# Altium schematic sheet Page05 LPDDR4.SchDoc
size 513 x 386 mm
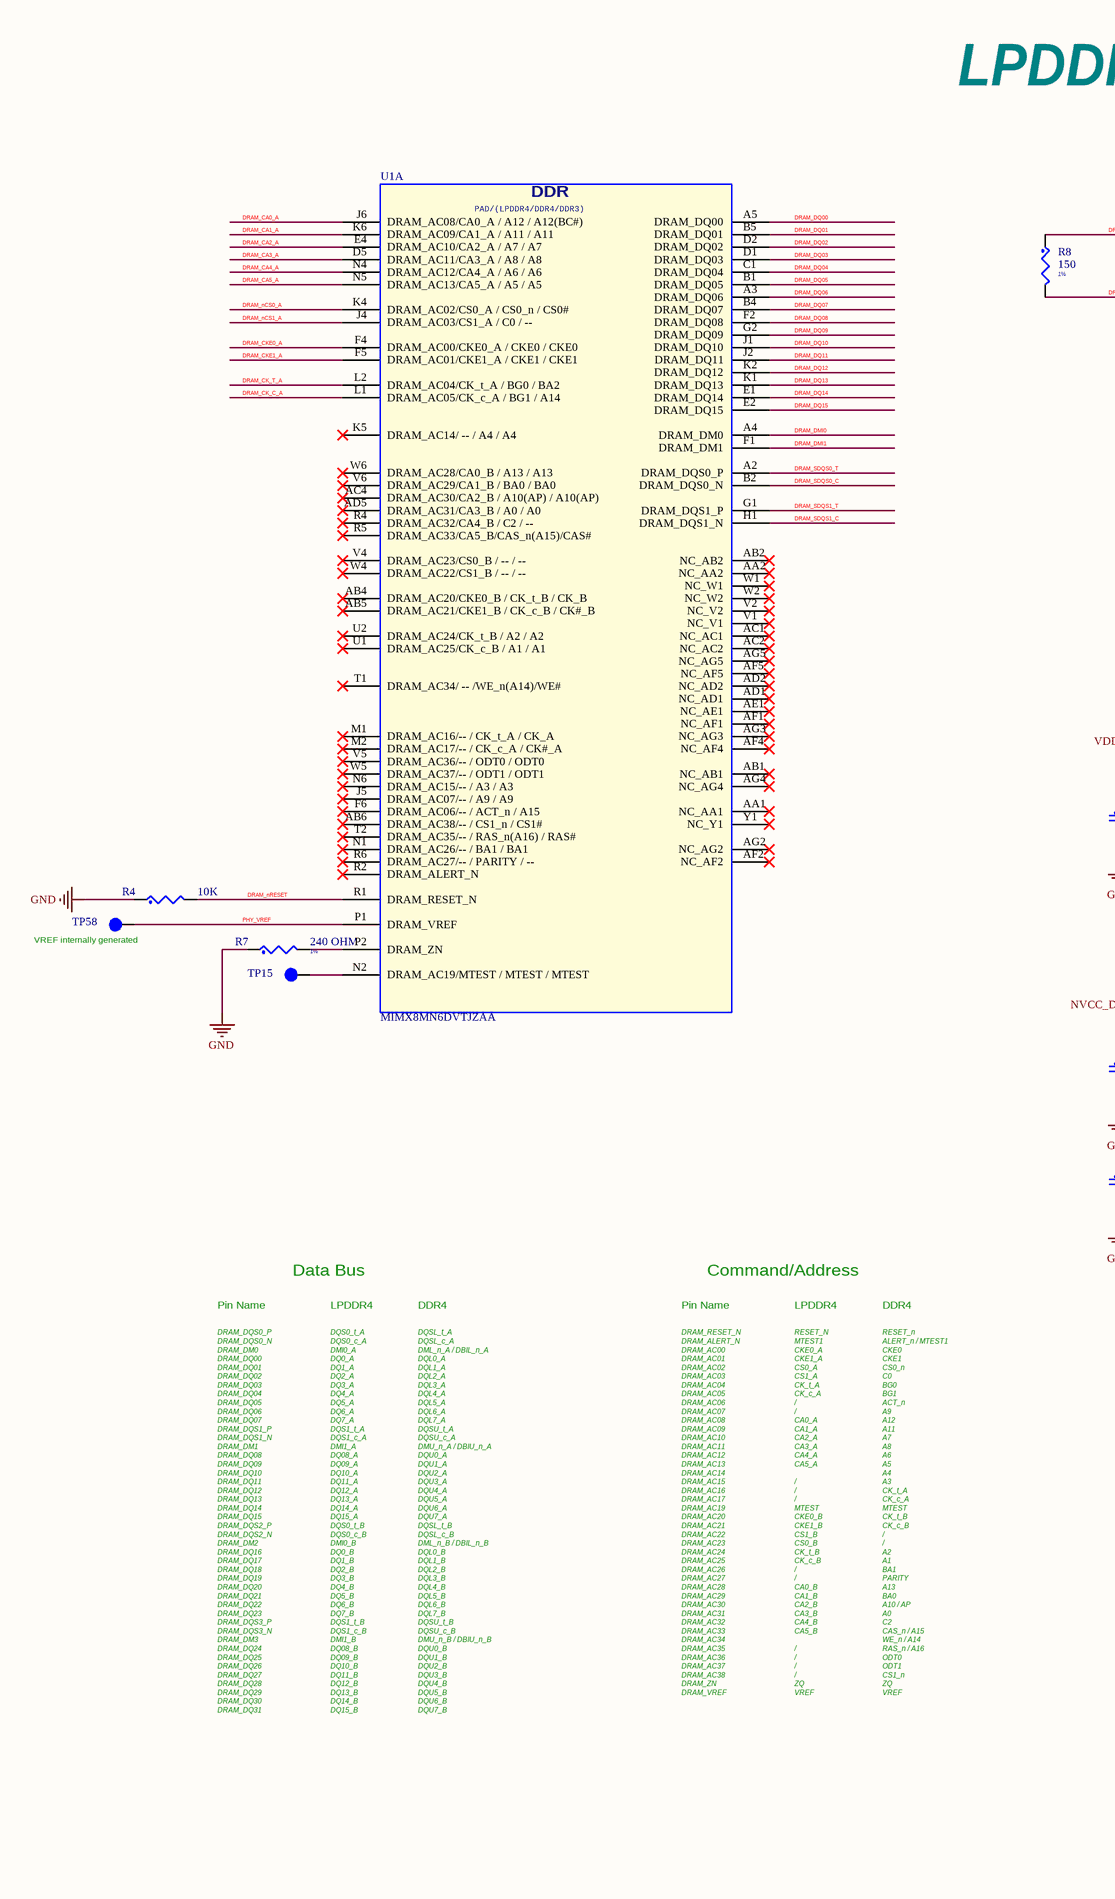
[diagram p0: Page05 LPDDR4.SchDoc, left]
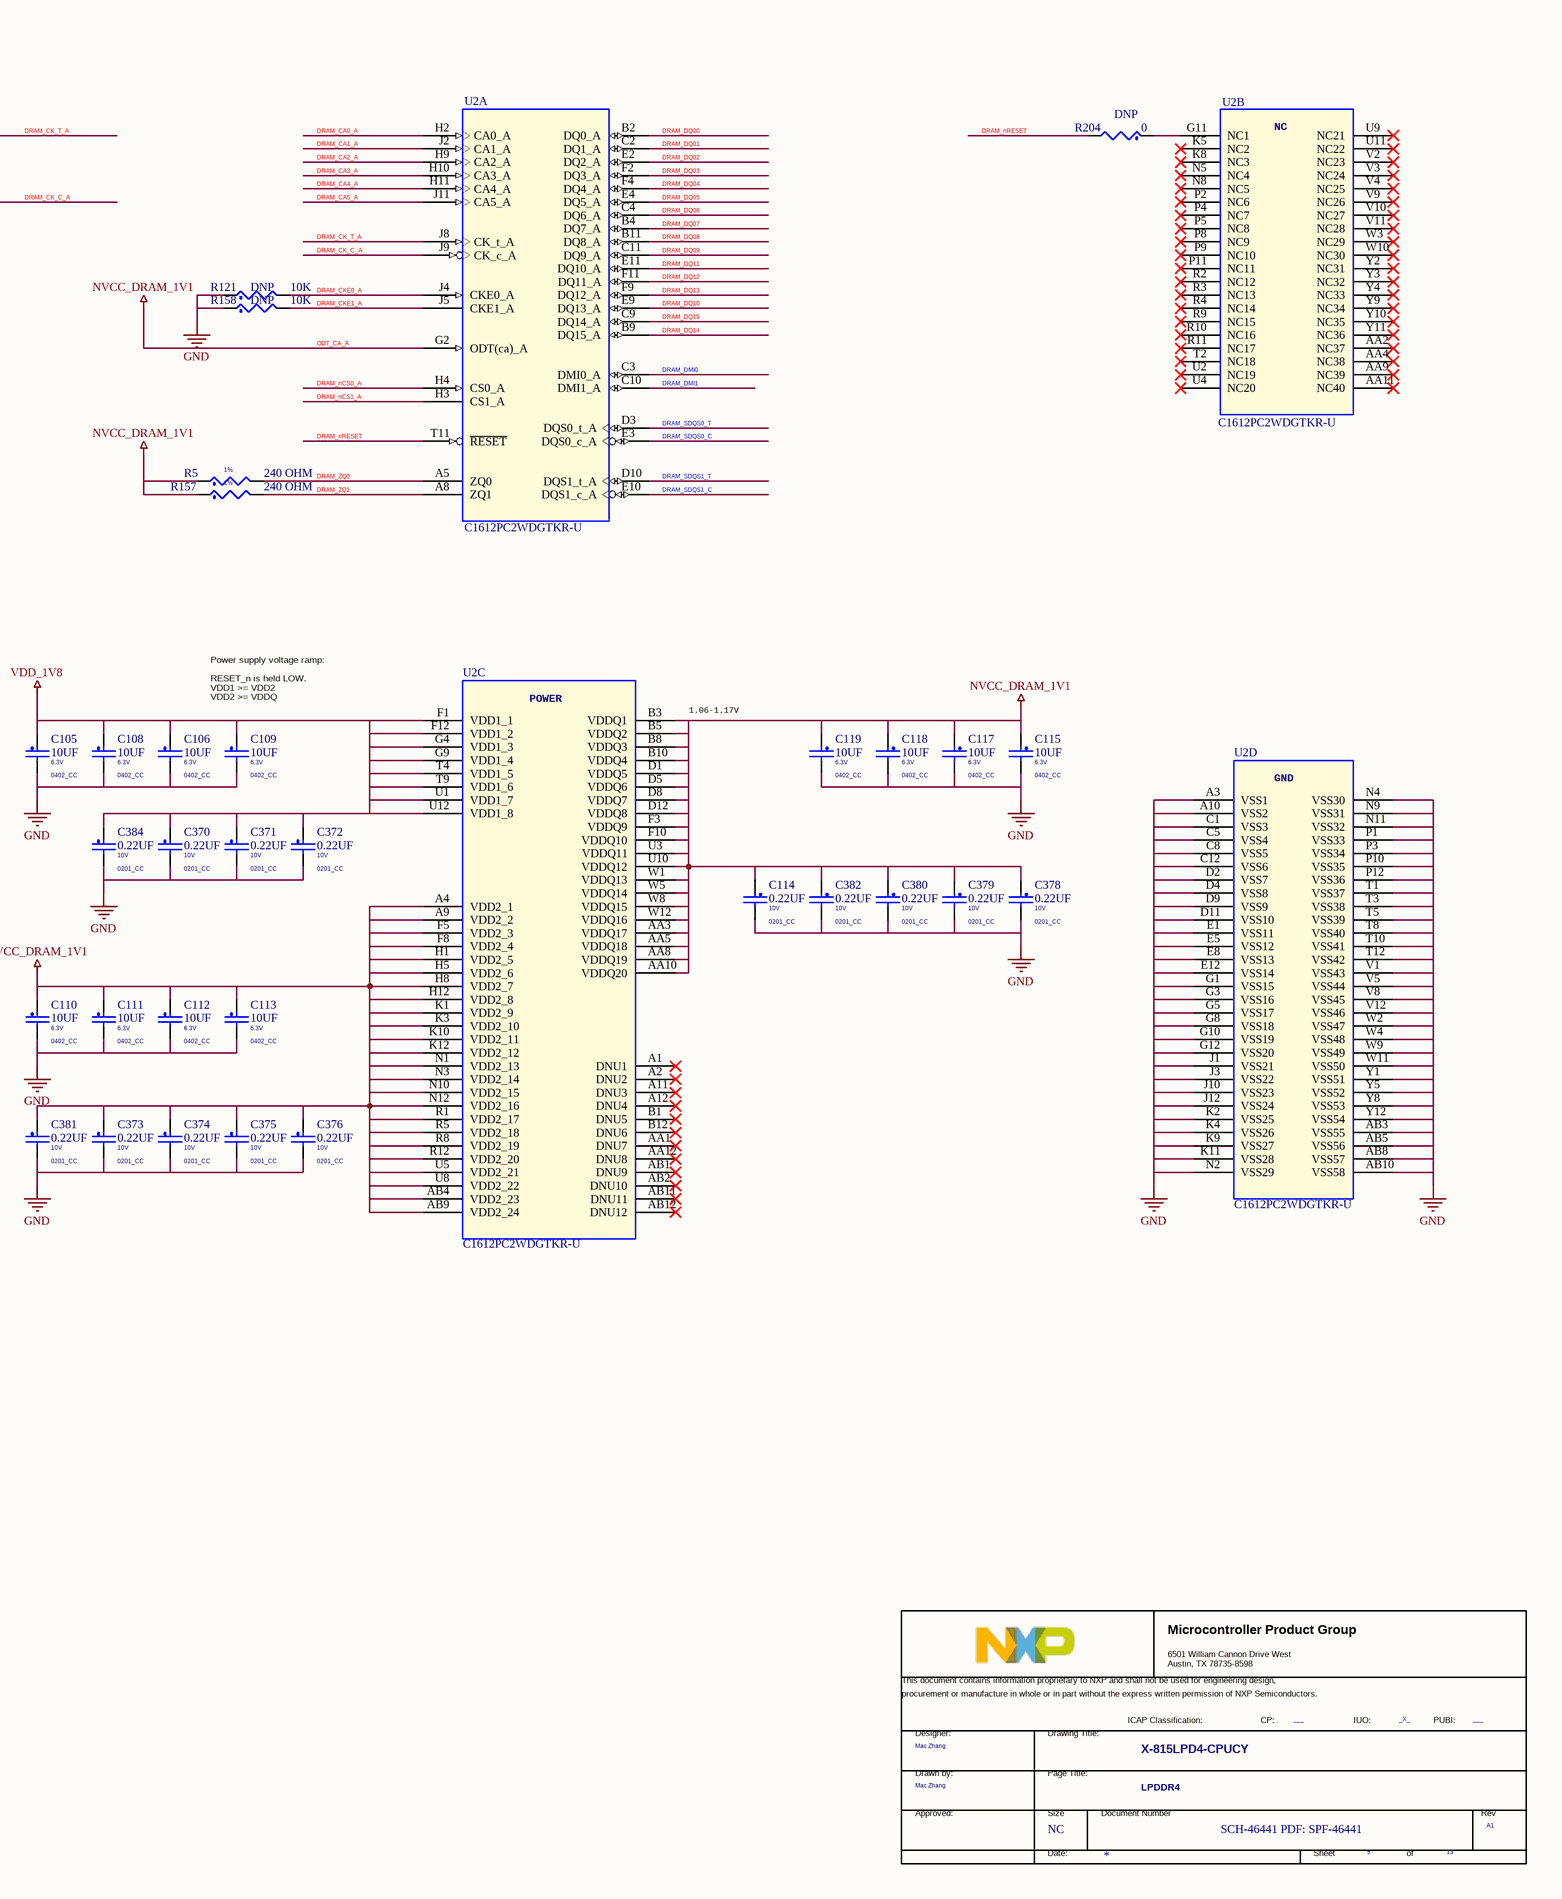
[diagram p1: Page05 LPDDR4.SchDoc, right]

## Parts
*  Doc: SCH-46441 PDF: SPF-46441  RevCode: A1  Title: X-815LPD4-CPUCY  Page Size: NC  Page Number: 5  Page Count: 13  PageTitle: LPDDR4  Designer: Mac Zhang  PUBI: ___  FIUO: _X_  (hidden comment: TitleBlock_MCPG)  (graphical)
C105  10UF  VOLTAGE: 6.3V  [0402_CC]
C106  10UF  VOLTAGE: 6.3V  [0402_CC]
C108  10UF  VOLTAGE: 6.3V  [0402_CC]
C109  10UF  VOLTAGE: 6.3V  [0402_CC]
C110  10UF  VOLTAGE: 6.3V  [0402_CC]
C111  10UF  VOLTAGE: 6.3V  [0402_CC]
C112  10UF  VOLTAGE: 6.3V  [0402_CC]
C113  10UF  VOLTAGE: 6.3V  [0402_CC]
C114  0.22UF  VOLTAGE: 10V  [0201_CC]
C115  10UF  VOLTAGE: 6.3V  [0402_CC]
C117  10UF  VOLTAGE: 6.3V  [0402_CC]
C118  10UF  VOLTAGE: 6.3V  [0402_CC]
C119  10UF  VOLTAGE: 6.3V  [0402_CC]
C370  0.22UF  VOLTAGE: 10V  [0201_CC]
C371  0.22UF  VOLTAGE: 10V  [0201_CC]
C372  0.22UF  VOLTAGE: 10V  [0201_CC]
C373  0.22UF  VOLTAGE: 10V  [0201_CC]
C374  0.22UF  VOLTAGE: 10V  [0201_CC]
C375  0.22UF  VOLTAGE: 10V  [0201_CC]
C376  0.22UF  VOLTAGE: 10V  [0201_CC]
C378  0.22UF  VOLTAGE: 10V  [0201_CC]
C379  0.22UF  VOLTAGE: 10V  [0201_CC]
C380  0.22UF  VOLTAGE: 10V  [0201_CC]
C381  0.22UF  VOLTAGE: 10V  [0201_CC]
C382  0.22UF  VOLTAGE: 10V  [0201_CC]
C384  0.22UF  VOLTAGE: 10V  [0201_CC]
R4  10K  [0201_CC]
R5  240 OHM  Tolerance: 1%  [0201_CC]
R7  240 OHM  Tolerance: 1%  [0201_CC]
R8  150  Tolerance: 1%  [0402_CC]
R121  10K  ASSY_OPT: DNP  [0201_CC]
R157  240 OHM  Tolerance: 1%  [0201_CC]
R158  10K  ASSY_OPT: DNP  [0201_CC]
R204  0  ASSY_OPT: DNP  [0402_CC]
TP15  tpad_020  [tpad_020]  (value not drawn)
TP58  tpad_020  [tpad_020]  (value not drawn)
U1  MIMX8MN6DVTJZAA  [bga486_0p5_14x14]  (part A of 14)
U2  C1612PC2WDGTKR-U  [bga200_0p65x0p8_10p1x14p6]  (parts A,B,C,D of 4)

## Nets
GND: C105.2 C106.2 C108.2 C109.2 C110.2 C111.2 C112.2 C113.2 C114.2 C115.2 C117.2 C118.2 C119.2 C370.2 C371.2 C372.2 C373.2 C374.2 C375.2 C376.2 C378.2 C379.2 C380.2 C381.2 C382.2 C384.2 R4.1 R7.1 R121.1 R158.1 U2.A3(VSS1) U2.A10(VSS2) U2.AB3(VSS55) U2.AB5(VSS56) U2.AB8(VSS57) U2.AB10(VSS58) U2.C1(VSS3) U2.C5(VSS4) U2.C8(VSS5) U2.C12(VSS6) U2.D2(VSS7) U2.D4(VSS8) U2.D9(VSS9) U2.D11(VSS10) U2.E1(VSS11) U2.E5(VSS12) U2.E8(VSS13) U2.E12(VSS14) U2.G1(VSS15) U2.G3(VSS16) U2.G5(VSS17) U2.G8(VSS18) U2.G10(VSS19) U2.G12(VSS20) U2.J1(VSS21) U2.J3(VSS22) U2.J10(VSS23) U2.J12(VSS24) U2.K2(VSS25) U2.K4(VSS26) U2.K9(VSS27) U2.K11(VSS28) U2.N2(VSS29) U2.N4(VSS30) U2.N9(VSS31) U2.N11(VSS32) U2.P1(VSS33) U2.P3(VSS34) U2.P10(VSS35) U2.P12(VSS36) U2.T1(VSS37) U2.T3(VSS38) U2.T5(VSS39) U2.T8(VSS40) U2.T10(VSS41) U2.T12(VSS42) U2.V1(VSS43) U2.V5(VSS44) U2.V8(VSS45) U2.V12(VSS46) U2.W2(VSS47) U2.W4(VSS48) U2.W9(VSS49) U2.W11(VSS50) U2.Y1(VSS51) U2.Y5(VSS52) U2.Y8(VSS53) U2.Y12(VSS54)
ODT_CA_A: C110.1 C111.1 C112.1 C113.1 C114.1 C115.1 C117.1 C118.1 C119.1 C373.1 C374.1 C375.1 C376.1 C378.1 C379.1 C380.1 C381.1 C382.1 R5.1 R157.1 U2.A4(VDD2_1) U2.A9(VDD2_2) U2.AA3(VDDQ17) U2.AA5(VDDQ18) U2.AA8(VDDQ19) U2.AA10(VDDQ20) U2.AB4(VDD2_23) U2.AB9(VDD2_24) U2.B3(VDDQ1) U2.B5(VDDQ2) U2.B8(VDDQ3) U2.B10(VDDQ4) U2.D1(VDDQ5) U2.D5(VDDQ6) U2.D8(VDDQ7) U2.D12(VDDQ8) U2.F3(VDDQ9) U2.F5(VDD2_3) U2.F8(VDD2_4) U2.F10(VDDQ10) U2.G2(ODT(ca)_A) U2.H1(VDD2_5) U2.H5(VDD2_6) U2.H8(VDD2_7) U2.H12(VDD2_8) U2.K1(VDD2_9) U2.K3(VDD2_10) U2.K10(VDD2_11) U2.K12(VDD2_12) U2.N1(VDD2_13) U2.N3(VDD2_14) U2.N10(VDD2_15) U2.N12(VDD2_16) U2.R1(VDD2_17) U2.R5(VDD2_18) U2.R8(VDD2_19) U2.R12(VDD2_20) U2.U3(VDDQ11) U2.U5(VDD2_21) U2.U8(VDD2_22) U2.U10(VDDQ12) U2.W1(VDDQ13) U2.W5(VDDQ14) U2.W8(VDDQ15) U2.W12(VDDQ16)  [also labelled NVCC_DRAM_1V1]
VDD_1V8: C105.1 C106.1 C108.1 C109.1 C370.1 C371.1 C372.1 C384.1 U2.F1(VDD1_1) U2.F12(VDD1_2) U2.G4(VDD1_3) U2.G9(VDD1_4) U2.T4(VDD1_5) U2.T9(VDD1_6) U2.U1(VDD1_7) U2.U12(VDD1_8)
DRAM_CA0_A: U1.J6(DRAM_AC08/CA0_A_/_A12_/_A12(BC#)) U2.H2(CA0_A)
DRAM_CA1_A: U1.K6(DRAM_AC09/CA1_A_/_A11_/_A11) U2.J2(CA1_A)
DRAM_CA2_A: U1.E4(DRAM_AC10/CA2_A_/_A7_/_A7) U2.H9(CA2_A)
DRAM_CA3_A: U1.D5(DRAM_AC11/CA3_A_/_A8_/_A8) U2.H10(CA3_A)
DRAM_CA4_A: U1.N4(DRAM_AC12/CA4_A_/_A6_/_A6) U2.H11(CA4_A)
DRAM_CA5_A: U1.N5(DRAM_AC13/CA5_A_/_A5_/_A5) U2.J11(CA5_A)
DRAM_CK_C_A: R8.2 U1.L1(DRAM_AC05/CK_c_A_/_BG1_/_A14) U2.J9(CK_c_A)
DRAM_CK_T_A: R8.1 U1.L2(DRAM_AC04/CK_t_A_/_BG0_/_BA2) U2.J8(CK_t_A)
DRAM_CKE0_A: R121.2 U1.F4(DRAM_AC00/CKE0_A_/_CKE0_/_CKE0) U2.J4(CKE0_A)
DRAM_CKE1_A: R158.2 U1.F5(DRAM_AC01/CKE1_A_/_CKE1_/_CKE1) U2.J5(CKE1_A)
DRAM_DMI0: U1.A4(DRAM_DM0) U2.C3(DMI0_A)
DRAM_DMI1: U1.F1(DRAM_DM1) U2.C10(DMI1_A)
DRAM_DQ00: U1.A5(DRAM_DQ00) U2.B2(DQ0_A)
DRAM_DQ01: U1.B5(DRAM_DQ01) U2.C2(DQ1_A)
DRAM_DQ02: U1.D2(DRAM_DQ02) U2.E2(DQ2_A)
DRAM_DQ03: U1.D1(DRAM_DQ03) U2.F2(DQ3_A)
DRAM_DQ04: U1.C1(DRAM_DQ04) U2.F4(DQ4_A)
DRAM_DQ05: U1.B1(DRAM_DQ05) U2.E4(DQ5_A)
DRAM_DQ06: U1.A3(DRAM_DQ06) U2.C4(DQ6_A)
DRAM_DQ07: U1.B4(DRAM_DQ07) U2.B4(DQ7_A)
DRAM_DQ08: U1.F2(DRAM_DQ08) U2.B11(DQ8_A)
DRAM_DQ09: U1.G2(DRAM_DQ09) U2.C11(DQ9_A)
DRAM_DQ10: U1.J1(DRAM_DQ10) U2.E9(DQ13_A)
DRAM_DQ11: U1.J2(DRAM_DQ11) U2.E11(DQ10_A)
DRAM_DQ12: U1.K2(DRAM_DQ12) U2.F11(DQ11_A)
DRAM_DQ13: U1.K1(DRAM_DQ13) U2.F9(DQ12_A)
DRAM_DQ14: U1.E1(DRAM_DQ14) U2.B9(DQ15_A)
DRAM_DQ15: U1.E2(DRAM_DQ15) U2.C9(DQ14_A)
DRAM_nCS0_A: U1.K4(DRAM_AC02/CS0_A_/_CS0_n_/_CS0#) U2.H4(CS0_A)
DRAM_nCS1_A: U1.J4(DRAM_AC03/CS1_A_/_C0_/_--) U2.H3(CS1_A)
DRAM_nRESET: R4.2 R204.2 U1.R1(DRAM_RESET_N) U2.T11(~{RESET})
DRAM_SDQS0_C: U1.B2(DRAM_DQS0_N) U2.E3(DQS0_c_A)
DRAM_SDQS0_T: U1.A2(DRAM_DQS0_P) U2.D3(DQS0_t_A)
DRAM_SDQS1_C: U1.H1(DRAM_DQS1_N) U2.E10(DQS1_c_A)
DRAM_SDQS1_T: U1.G1(DRAM_DQS1_P) U2.D10(DQS1_t_A)
DRAM_ZQ0: R5.2 U2.A5(ZQ0)
DRAM_ZQ1: R157.2 U2.A8(ZQ1)
PHY_VREF: TP58.1(Pin1) U1.P1(DRAM_VREF)
NetR7_2: R7.2 U1.P2(DRAM_ZN)
NetR204_1: R204.1 U2.G11(NC1)
NetTP15_1: TP15.1(Pin1) U1.N2(DRAM_AC19/MTEST_/_MTEST_/_MTEST)

Not connected (* = marked no-connect by the designer): U1 AA1(NC_AA1)* AA2(NC_AA2)* AB1(NC_AB1)* AB2(NC_AB2)* AB4(DRAM_AC20/CKE0_B_/_CK_t_B_/_CK_B)* AB5(DRAM_AC21/CKE1_B_/_CK_c_B_/_CK#_B)* AB6(DRAM_AC38/--_/_CS1_n_/_CS1#)* AC1(NC_AC1)* AC2(NC_AC2)* AC4(DRAM_AC30/CA2_B_/_A10(AP)_/_A10(AP))* AD1(NC_AD1)* AD2(NC_AD2)* AD5(DRAM_AC31/CA3_B_/_A0_/_A0)* AE1(NC_AE1)* AF1(NC_AF1)* AF2(NC_AF2)* AF4(NC_AF4)* AF5(NC_AF5)* AG2(NC_AG2)* AG3(NC_AG3)* AG4(NC_AG4)* AG5(NC_AG5)* F6(DRAM_AC06/--_/_ACT_n_/_A15)* J5(DRAM_AC07/--_/_A9_/_A9)* K5(DRAM_AC14/_--_/_A4_/_A4)* M1(DRAM_AC16/--_/_CK_t_A_/_CK_A)* M2(DRAM_AC17/--_/_CK_c_A_/_CK#_A)* N1(DRAM_AC26/--_/_BA1_/_BA1)* N6(DRAM_AC15/--_/_A3_/_A3)* R2(DRAM_ALERT_N)* R4(DRAM_AC32/CA4_B_/_C2_/_--)* R5(DRAM_AC33/CA5_B/CAS_n(A15)/CAS#)* R6(DRAM_AC27/--_/_PARITY_/_--)* T1(DRAM_AC34/_--_/WE_n(A14)/WE#)* T2(DRAM_AC35/--_/_RAS_n(A16)_/_RAS#)* U1(DRAM_AC25/CK_c_B_/_A1_/_A1)* U2(DRAM_AC24/CK_t_B_/_A2_/_A2)* V1(NC_V1)* V2(NC_V2)* V4(DRAM_AC23/CS0_B_/_--_/_--)* V5(DRAM_AC36/--_/_ODT0_/_ODT0)* V6(DRAM_AC29/CA1_B_/_BA0_/_BA0)* W1(NC_W1)* W2(NC_W2)* W4(DRAM_AC22/CS1_B_/_--_/_--)* W5(DRAM_AC37/--_/_ODT1_/_ODT1)* W6(DRAM_AC28/CA0_B_/_A13_/_A13)* Y1(NC_Y1)*; U2 A1(DNU1)* A2(DNU2)* A11(DNU3)* A12(DNU4)* AA1(DNU7)* AA2(NC37)* AA4(NC38)* AA9(NC39)* AA11(NC40)* AA12(DNU8)* AB1(DNU9)* AB2(DNU10)* AB11(DNU11)* AB12(DNU12)* B1(DNU5)* B12(DNU6)* K5(NC2)* K8(NC3)* N5(NC4)* N8(NC5)* P2(NC6)* P4(NC7)* P5(NC8)* P8(NC9)* P9(NC10)* P11(NC11)* R2(NC12)* R3(NC13)* R4(NC14)* R9(NC15)* R10(NC16)* R11(NC17)* T2(NC18)* U2(NC19)* U4(NC20)* U9(NC21)* U11(NC22)* V2(NC23)* V3(NC24)* V4(NC25)* V9(NC26)* V10(NC27)* V11(NC28)* W3(NC29)* W10(NC30)* Y2(NC31)* Y3(NC32)* Y4(NC33)* Y9(NC34)* Y10(NC35)* Y11(NC36)*

## Notes on the sheet
- LPDDR4 2GB
- Power supply voltage ramp:
  RESET_n is held LOW.
  VDD1 >= VDD2
  VDD2 >= VDDQ
- 1.06-1.17V
- (near TP58) VREF internally generated
- Data Bus
- Command/Address
- Pin Name
- DRAM_DQS0_P
  DRAM_DQS0_N
  DRAM_DM0
  DRAM_DQ00
  DRAM_DQ01
  DRAM_DQ02
  DRAM_DQ03
  DRAM_DQ04
  DRAM_DQ05
  DRAM_DQ06
  DRAM_DQ07
  DRAM_DQS1_P
  DRAM_DQS1_N
  DRAM_DM1
  DRAM_DQ08
  DRAM_DQ09
  DRAM_DQ10
  DRAM_DQ11
  DRAM_DQ12
  DRAM_DQ13
  DRAM_DQ14
  DRAM_DQ15
  DRAM_DQS2_P
  DRAM_DQS2_N
  DRAM_DM2
  DRAM_DQ16
  DRAM_DQ17
  DRAM_DQ18
  DRAM_DQ19
  DRAM_DQ20
  DRAM_DQ21
  DRAM_DQ22
  DRAM_DQ23
  DRAM_DQS3_P
  DRAM_DQS3_N
  DRAM_DM3
  DRAM_DQ24
  DRAM_DQ25
  DRAM_DQ26
  DRAM_DQ27
  DRAM_DQ28
  DRAM_DQ29
  DRAM_DQ30
  DRAM_DQ31
- DQS0_t_A
  DQS0_c_A
  DMI0_A
  DQ0_A
  DQ1_A
  DQ2_A
  DQ3_A
  DQ4_A
  DQ5_A
  DQ6_A
  DQ7_A
  DQS1_t_A
  DQS1_c_A
  DMI1_A
  DQ08_A
  DQ09_A
  DQ10_A
  DQ11_A
  DQ12_A
  DQ13_A
  DQ14_A
  DQ15_A
  DQS0_t_B
  DQS0_c_B
  DMI0_B
  DQ0_B
  DQ1_B
  DQ2_B
  DQ3_B
  DQ4_B
  DQ5_B
  DQ6_B
  DQ7_B
  DQS1_t_B
  DQS1_c_B
  DMI1_B
  DQ08_B
  DQ09_B
  DQ10_B
  DQ11_B
  DQ12_B
  DQ13_B
  DQ14_B
  DQ15_B
- LPDDR4
- DQSL_t_A
  DQSL_c_A
  DML_n_A / DBIL_n_A
  DQL0_A
  DQL1_A
  DQL2_A
  DQL3_A
  DQL4_A
  DQL5_A
  DQL6_A
  DQL7_A
  DQSU_t_A
  DQSU_c_A
  DMU_n_A / DBIU_n_A
  DQU0_A
  DQU1_A
  DQU2_A
  DQU3_A
  DQU4_A
  DQU5_A
  DQU6_A
  DQU7_A
  DQSL_t_B
  DQSL_c_B
  DML_n_B / DBIL_n_B
  DQL0_B
  DQL1_B
  DQL2_B
  DQL3_B
  DQL4_B
  DQL5_B
  DQL6_B
  DQL7_B
  DQSU_t_B
  DQSU_c_B
  DMU_n_B / DBIU_n_B
  DQU0_B
  DQU1_B
  DQU2_B
  DQU3_B
  DQU4_B
  DQU5_B
  DQU6_B
  DQU7_B
- DDR4
- DRAM_RESET_N
  DRAM_ALERT_N
  DRAM_AC00
  DRAM_AC01
  DRAM_AC02
  DRAM_AC03
  DRAM_AC04
  DRAM_AC05
  DRAM_AC06
  DRAM_AC07
  DRAM_AC08
  DRAM_AC09
  DRAM_AC10
  DRAM_AC11
  DRAM_AC12
  DRAM_AC13
  DRAM_AC14
  DRAM_AC15
  DRAM_AC16
  DRAM_AC17
  DRAM_AC19
  DRAM_AC20
  DRAM_AC21
  DRAM_AC22
  DRAM_AC23
  DRAM_AC24
  DRAM_AC25
  DRAM_AC26
  DRAM_AC27
  DRAM_AC28
  DRAM_AC29
  DRAM_AC30
  DRAM_AC31
  DRAM_AC32
  DRAM_AC33
  DRAM_AC34
  DRAM_AC35
  DRAM_AC36
  DRAM_AC37
  DRAM_AC38
  DRAM_ZN
  DRAM_VREF
- RESET_N
  MTEST1
  CKE0_A
  CKE1_A
  CS0_A
  CS1_A
  CK_t_A
  CK_c_A
  /
  /
  CA0_A
  CA1_A
  CA2_A
  CA3_A
  CA4_A
  CA5_A
  /
  /
  /
  MTEST
  CKE0_B
  CKE1_B
  CS1_B
  CS0_B
  CK_t_B
  CK_c_B
  /
  /
  CA0_B
  CA1_B
  CA2_B
  CA3_B
  CA4_B
  CA5_B
  /
  /
  /
  /
  ZQ
  VREF
- RESET_n
  ALERT_n / MTEST1
  CKE0
  CKE1
  CS0_n
  C0
  BG0
  BG1
  ACT_n
  A9
  A12
  A11
  A7
  A8
  A6
  A5
  A4
  A3
  CK_t_A
  CK_c_A
  MTEST
  CK_t_B
  CK_c_B
  /
  /
  A2
  A1
  BA1
  PARITY
  A13
  BA0
  A10 / AP
  A0
  C2
  CAS_n / A15
  WE_n / A14
  RAS_n / A16
  ODT0
  ODT1
  CS1_n
  ZQ
  VREF
- (in symbol C1612PC2WDGTKR-U_BGA200P, part B) NC
- (in symbol C1612PC2WDGTKR-U_BGA200P, part C) POWER
- (in symbol C1612PC2WDGTKR-U_BGA200P, part D) GND
- (in symbol MIMX8NN_BGA486P, part A) DDR; PAD/(LPDDR4/DDR4/DDR3)
- (in symbol TitleBlock_MCPG) Microcontroller Product Group; 6501 William Cannon Drive West / Austin, TX 78735-8598; This document contains information proprietary to NXP and shall not be used for engineering design,; procurement or manufacture in whole or in part without the express written permission of NXP Semiconductors.; ICAP Classification:; CP:; IUO:; PUBI:; Designer:; Drawing Title:; Drawn by:; Page Title:; Approved:; Size; Document Number; Rev; Date:; Sheet; of

## Library data of the parts
* = TitleBlock_MCPG: OrgAddr1: NO. 192 Liangjing Rd. Pudong New Area, ShangHai; OrgName: NXP Semiconductor; Page Create Date: March  8, 1995; DrawnBy: Mac Zhang; FCP: ___; Page Modify Date: *
C105 C115 C117 C118 = CAP_NP: CAP CER 10UF 6.3V 20% X5R 0402; CLASS: DISCRETE; FPLIST: CC0402_25,CC0402_HD,0402_CC; CAD_APPROVED: Yes; MFG_PN01: CL05A106MQ5NUNC; MFG_NAME01: SAMSUNG ELECTRO MECHANICS; AGILE_PN: 150-79163; HEIGHT: 0.65 MM; ROHS: Yes; Tolerance: 20%; PCB Footprint: 0402_CC
C106 C108-C113 C119 = CAP_NP: CAP CER 10UF 6.3V 20% X5R 0402; CLASS: DISCRETE; AGILE_PN: 150-79163; MFG_NAME01: SAMSUNG ELECTRO MECHANICS; MFG_PN01: CL05A106MQ5NUNC; CAD_APPROVED: Yes; FPLIST: CC0402_25,CC0402_HD,0402_CC; Tolerance: 20%; ROHS: Yes; HEIGHT: 0.65 MM; PCB Footprint: 0402_CC
C114 C370 C372 C373 C375 C382 = CAP_NP: CAP CER 0.22UF 10V 20% X5R 0201; CLASS: DISCRETE; FPLIST: CC0201,CC0201_HD,0201_CC; CAD_APPROVED: Yes; MFG_PN01: LMK063BJ224MP-F; MFG_NAME01: Taiyo Yuden; AGILE_PN: 150-78815; PCB Footprint: 0201_CC; HEIGHT: 0.33MM; ROHS: Yes; Tolerance: 20%
C371 C374 C376 C378-C381 C384 = CAP_NP: CAP CER 0.22UF 10V 20% X5R 0201; CLASS: DISCRETE; AGILE_PN: 150-78815; MFG_NAME01: Taiyo Yuden; MFG_PN01: LMK063BJ224MP-F; CAD_APPROVED: Yes; FPLIST: CC0201,CC0201_HD,0201_CC; PCB Footprint: 0201_CC; Tolerance: 20%; ROHS: Yes; HEIGHT: 0.33MM
R4 = RES: RES MF 10K 1/20W 5% 0201; CLASS: DISCRETE; FPLIST: RC0201,0201_CC; CAD_APPROVED: Yes; MFG_PN01: RTT01103JTH; MFG_NAME01: RALEC ELECTRONIC CORP; AGILE_PN: 470-79719; PCB Footprint: 0201_CC; HEIGHT: 0.26 MM; ROHS: Yes; Tolerance: 5%
R5 R7 R157 = RES: RES MF 240 OHM 1/20W 1% 0201; CLASS: DISCRETE; Temp Range: -55¡ãC ~ 125¡ãC; VOLTAGE: 25V; FPLIST: CC0201,CC0201_HD,0201_CC; CAD_APPROVED: Yes; MFG_PN01: RC0201FR-07240RL; MFG_NAME01: YAGEO AMERICA; AGILE_PN: 470-81317; HEIGHT: 0.26MM; Temp_Range: -55¡ãC ~ 125¡ãC; ROHS: Yes; PCB Footprint: 0201_CC
R8 = RES: RES MF 150 OHM 1/16W 1% 0402; CLASS: DISCRETE; FPLIST: RC0402_25,RC0402_HD,0402_CC; CAD_APPROVED: Yes; MFG_PN01: NRCL04F1500TRF; MFG_NAME01: NIC COMPONENTS CORP; AGILE_PN: 470-75353; PCB Footprint: 0402_CC; HEIGHT: 0.4MM; ROHS: Yes
R121 R158 = RES: RES MF 10K 1/20W 5% 0201; CLASS: DISCRETE; AGILE_PN: 470-79719; MFG_NAME01: RALEC ELECTRONIC CORP; MFG_PN01: RTT01103JTH; CAD_APPROVED: Yes; FPLIST: RC0201,0201_CC; PCB Footprint: 0201_CC; Tolerance: 5%; ROHS: Yes; HEIGHT: 0.26 MM
R204 = RES: RES MF ZERO OHM 1/16W 5% 0402; CLASS: DISCRETE; AGILE_PN: 470-75394; MFG_NAME01: ROHM; MFG_PN01: MCR01MZPJ000; CAD_APPROVED: Yes; FPLIST: RC0402_25,RC0402_HD,RC0402_X2,0402_CC; TOL: 1%; SIGNAL_MODEL: DEFAULT_RESISTOR_10000OHM_2_1; VOLTAGE: 1/16W; Tolerance: 5%; ROHS: Yes; HEIGHT: 0.45 MM; PCB Footprint: 0402_CC
TP15 TP58 = TESTLOOP: TEST POINT PAD 0.5MM DIA SMT, NO PART TO ORDER; CLASS: IO; ASSY_OPT: DNP; AGILE_PN: 211-77484; CAD_APPROVED: Yes; PCB Footprint: tpad_020; ROHS: Yes; HEIGHT: 0.1MM
U1 = MIMX8NN_BGA486P: IC CPU QUAD CORTEX A53+M7 1.5GHZ BGA486; Temp Range: 0¡ãC to 95¡ãC; AGILE_PN: TMP-WF-35485; MFG_NAME01: NXP SEMICONDUCTORS; PRE_APN: 330-77106; CAD_APPROVED: Yes; CLASS: IC; PCB Footprint: bga486_0p5_14x14; MFG_PN01: MIMX8MN6DVTJZAA; ROHS: Yes; Temp_Range: 0¡ãC to 95¡ãC; HEIGHT: 1.25MM
U2 = C1612PC2WDGTKR-U_BGA200P: IC MEM LPDDR4 SDRAM 1024 Meg x 16 1.1V FBGA200; Temp Range: -10C to +85C; AGILE_PN: TMP-WF-36533; MFG_NAME01: KINGSTON TECHNOLOGY CORP; PRE_APN: 334-77858; CAD_APPROVED: Yes; CLASS: IC; VOLTAGE: 1.1V; MFG_PN01: C1612PC2WDGTKR-U; ROHS: Yes; Temp_Range: -10C to +85C; HEIGHT: 1.0MM; PCB Footprint: bga200_0p65x0p8_10p1x14p6